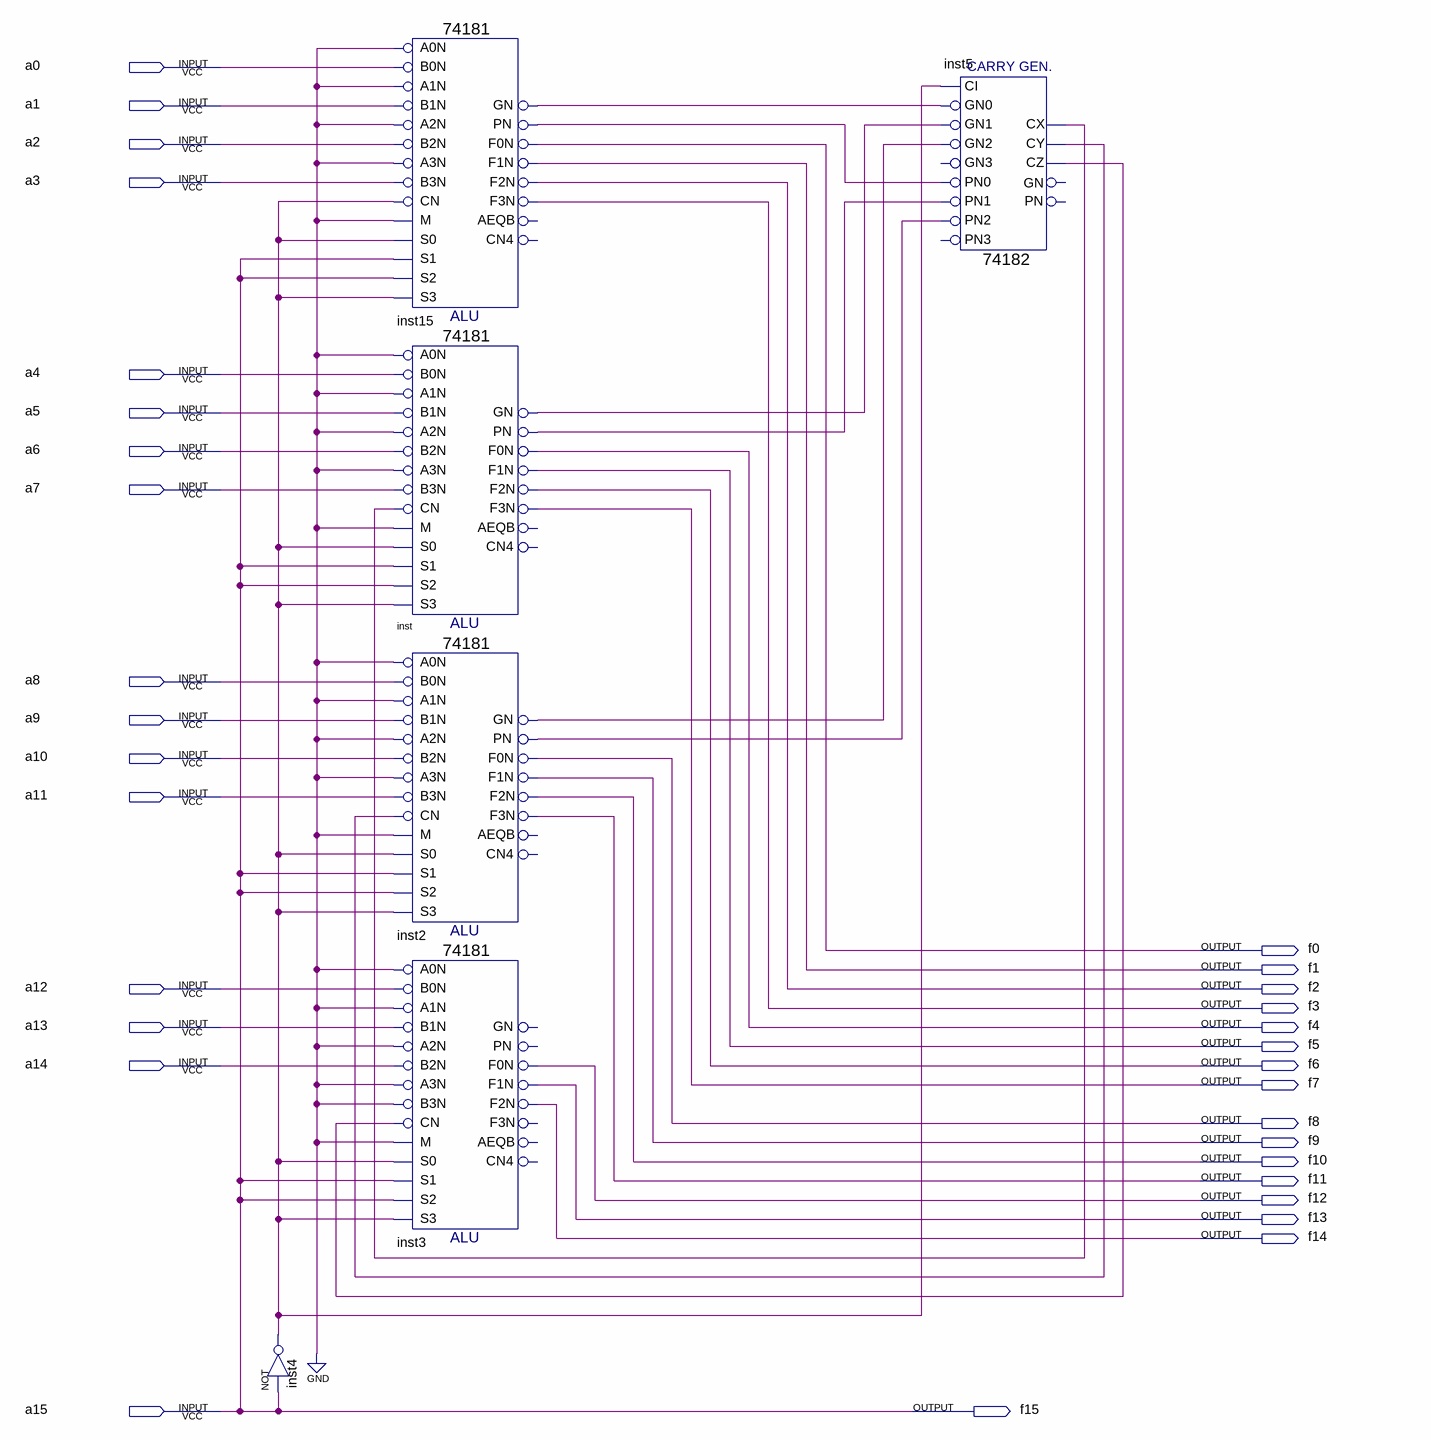
[diagram p0: schematic sheet]
// Quartus schematic YBDecoder.bdf as structural Verilog: 6 symbols, 32 pins
module YBDecoder (
  input  a0,
  input  a1,
  input  a2,
  input  a3,
  input  a4,
  input  a5,
  input  a6,
  input  a7,
  input  a8,
  input  a9,
  input  a10,
  input  a11,
  input  a12,
  input  a13,
  input  a14,
  input  a15,
  output f0,
  output f1,
  output f2,
  output f3,
  output f4,
  output f5,
  output f6,
  output f7,
  output f8,
  output f9,
  output f10,
  output f11,
  output f12,
  output f13,
  output f14,
  output f15
);

  wire inst2_gn, inst2_pn, inst4_out, inst5_cx, inst5_cy, inst5_cz, inst15_gn, inst15_pn, inst_gn, inst_pn;

  not inst4 (inst4_out, a15);
  \74181  inst15 (
    .B0N(a0), .A0N(1'b0), .A1N(1'b0), .B1N(a1), .A3N(1'b0), .B2N(a2), .A2N(1'b0), .M(1'b0), .CN(inst4_out),
    .B3N(a3), .S2(a15), .S1(a15), .S0(inst4_out), .S3(inst4_out), .PN(inst15_pn), .GN(inst15_gn), .F3N(f3),
    .F1N(f1), .F0N(f0), .F2N(f2));  // open: AEQB, CN4
  \74181  inst (
    .B0N(a4), .A0N(1'b0), .A1N(1'b0), .B1N(a5), .A3N(1'b0), .B2N(a6), .A2N(1'b0), .M(1'b0), .CN(inst5_cx),
    .B3N(a7), .S2(a15), .S1(a15), .S0(inst4_out), .S3(inst4_out), .PN(inst_pn), .GN(inst_gn), .F3N(f7),
    .F1N(f5), .F0N(f4), .F2N(f6));  // open: AEQB, CN4
  \74181  inst2 (
    .B0N(a8), .A0N(1'b0), .A1N(1'b0), .B1N(a9), .A3N(1'b0), .B2N(a10), .A2N(1'b0), .M(1'b0), .CN(inst5_cy),
    .B3N(a11), .S2(a15), .S1(a15), .S0(inst4_out), .S3(inst4_out), .PN(inst2_pn), .GN(inst2_gn), .F3N(f11),
    .F1N(f9), .F0N(f8), .F2N(f10));  // open: AEQB, CN4
  \74181  inst3 (
    .B0N(a12), .A0N(1'b0), .A1N(1'b0), .B1N(a13), .A3N(1'b0), .B2N(a14), .A2N(1'b0), .M(1'b0), .CN(inst5_cz),
    .B3N(1'b0), .S2(a15), .S1(a15), .S0(inst4_out), .S3(inst4_out), .F1N(f13), .F0N(f12), .F2N(f14));  // open: PN, GN, F3N, AEQB, CN4
  \74182  inst5 (
    .PN2(inst2_pn), .GN2(inst2_gn), .CI(inst4_out), .PN1(inst_pn), .PN0(inst15_pn), .GN1(inst_gn),
    .GN0(inst15_gn), .CY(inst5_cy), .CX(inst5_cx), .CZ(inst5_cz));  // open: GN3, PN3, PN, GN

  assign f15 = a15;
endmodule
